# Altium schematic sheet fhd-hdr.SchDoc: fhd-hdr
size 453 x 317 mm; Origin: Eagle; Date: 5/1/2023 6:37:17 AM; SheetNumber: 1; GateName_1: G$1; SymbolName_1: FRAME_B_L; LibraryName: frames; DeviceSetName: FRAME_B_L; GateName_2: G$2; SymbolName_2: DOCFIELD; Sheet: Sheet:; REV: REV:
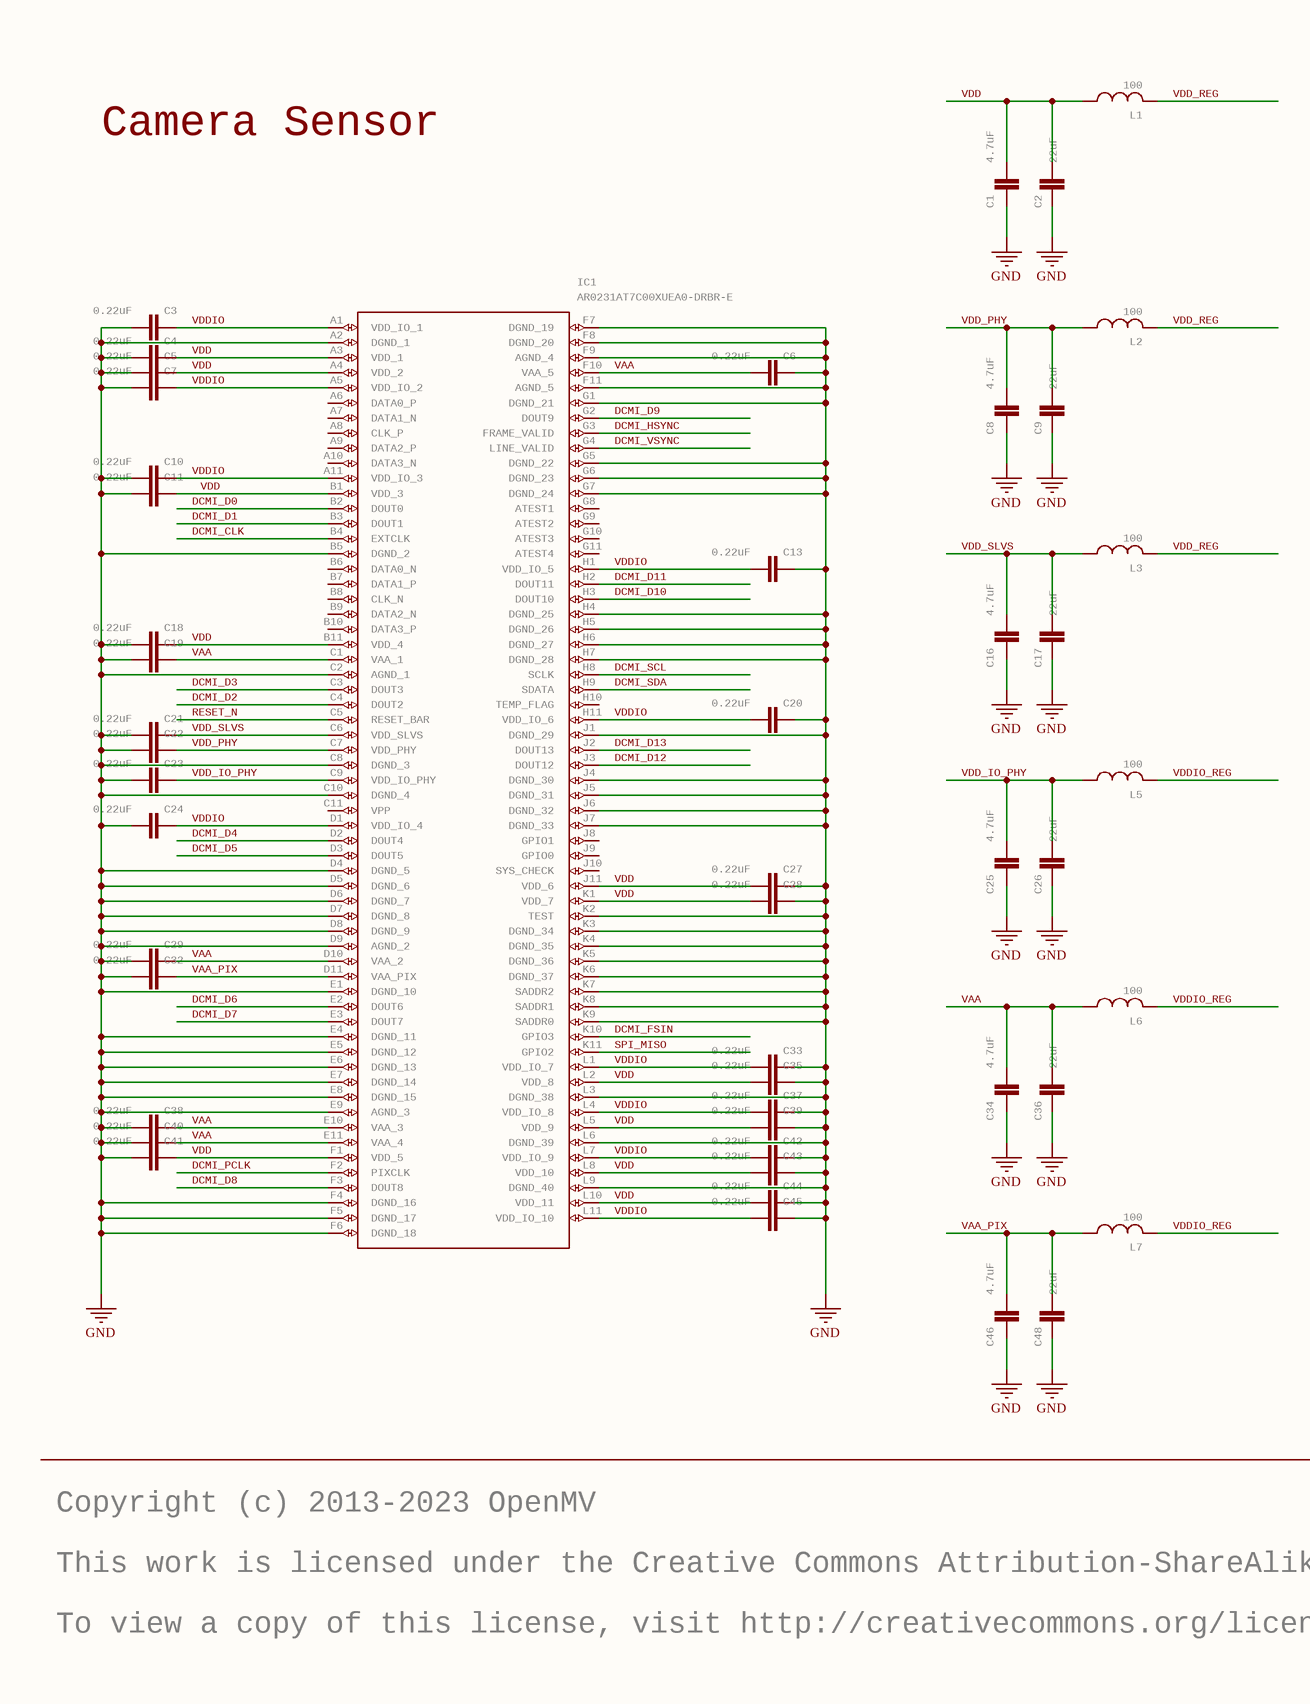
[diagram p0: fhd-hdr.SchDoc, left]
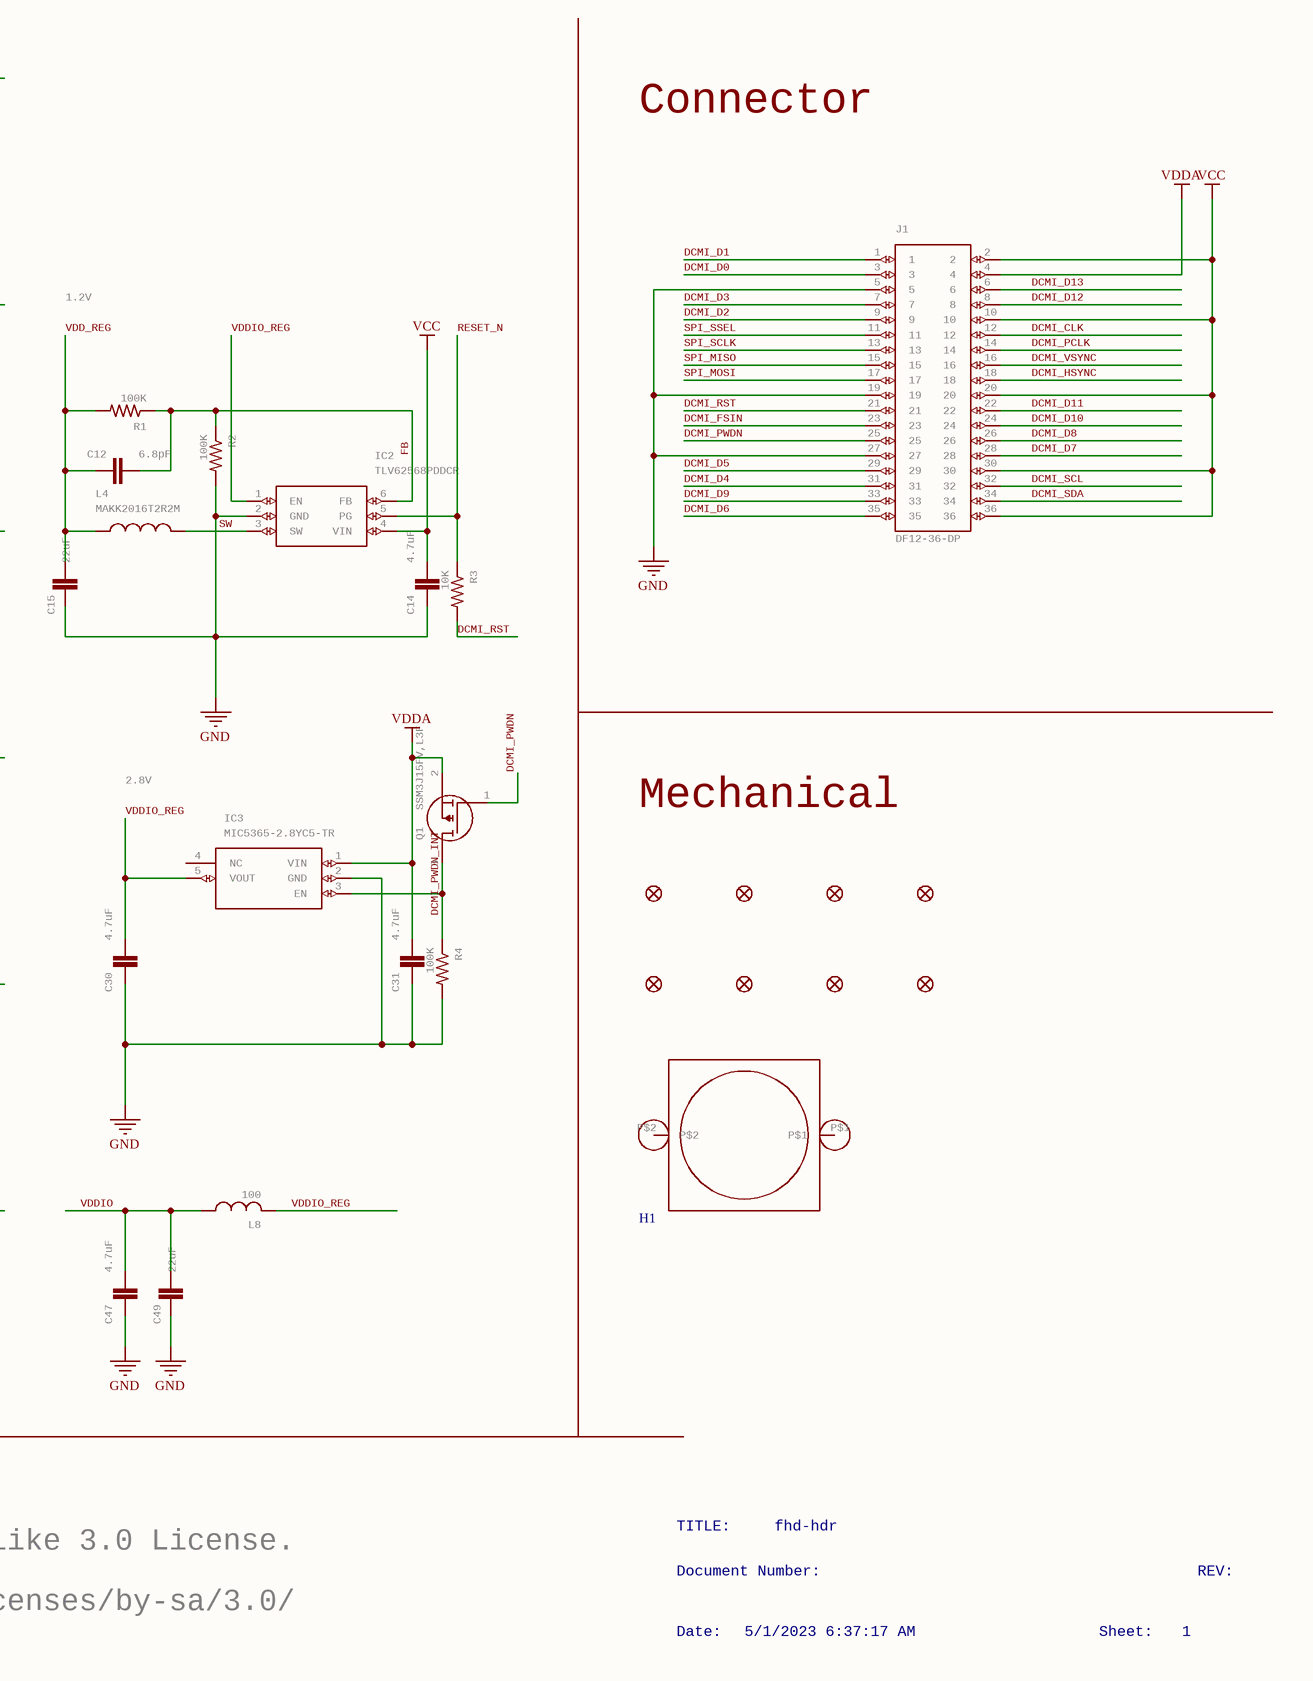
[diagram p1: fhd-hdr.SchDoc, right]

## Parts
C1  4.7uF  [0402]
C2  22uF  [0805]
C3  0.22uF  [C0201]
C4  0.22uF  [C0201]
C5  0.22uF  [C0201]
C6  0.22uF  [C0201]
C7  0.22uF  [C0201]
C8  4.7uF  [0402]
C9  22uF  [0805]
C10  0.22uF  [C0201]
C11  0.22uF  [C0201]
C12  6.8pF  [0402]
C13  0.22uF  [C0201]
C14  4.7uF  [0402]
C15  22uF  [0805]
C16  4.7uF  [0402]
C17  22uF  [0805]
C18  0.22uF  [C0201]
C19  0.22uF  [C0201]
C20  0.22uF  [C0201]
C21  0.22uF  [C0201]
C22  0.22uF  [C0201]
C23  0.22uF  [C0201]
C24  0.22uF  [C0201]
C25  4.7uF  [0402]
C26  22uF  [0805]
C27  0.22uF  [C0201]
C28  0.22uF  [C0201]
C29  0.22uF  [C0201]
C30  4.7uF  [0402]
C31  4.7uF  [0402]
C32  0.22uF  [C0201]
C33  0.22uF  [C0201]
C34  4.7uF  [0402]
C35  0.22uF  [C0201]
C36  22uF  [0805]
C37  0.22uF  [C0201]
C38  0.22uF  [C0201]
C39  0.22uF  [C0201]
C40  0.22uF  [C0201]
C41  0.22uF  [C0201]
C42  0.22uF  [C0201]
C43  0.22uF  [C0201]
C44  0.22uF  [C0201]
C45  0.22uF  [C0201]
C46  4.7uF  [0402]
C47  4.7uF  [0402]
C48  22uF  [0805]
C49  22uF  [0805]
FD1  FIDUCIAL1X2  [FIDUCIAL-1X2]  (value not drawn)
FD2  FIDUCIAL1X2  [FIDUCIAL-1X2]  (value not drawn)
FD3  FIDUCIAL1X2  [FIDUCIAL-1X2]  (value not drawn)
FD4  FIDUCIAL1X2  [FIDUCIAL-1X2]  (value not drawn)
FD5  FIDUCIAL1X2  [FIDUCIAL-1X2]  (value not drawn)
FD6  FIDUCIAL1X2  [FIDUCIAL-1X2]  (value not drawn)
FD7  FIDUCIAL1X2  [FIDUCIAL-1X2]  (value not drawn)
FD8  FIDUCIAL1X2  [FIDUCIAL-1X2]  (value not drawn)
H1  LENSMOUNT20MM  [LENSMOUNT-20MM]  (value not drawn)
IC1  AR0231AT7C00XUEA0-DRBR-E  [BGA121C80P11X11_1100X1000X155]
IC2  TLV62568PDDCR  [SOT95P280X110-6N]
IC3  MIC5365-2.8YC5-TR  [SOT65P210X110-5N]
J1  DF12-36-DP  [DF12-36-DP]
L1  100  [0402]
L2  100  [0402]
L3  100  [0402]
L4  MAKK2016T2R2M  [INDC2016X100N]
L5  100  [0402]
L6  100  [0402]
L7  100  [0402]
L8  100  [0402]
Q1  SSM3J15FV,L3F  [SSM3J15FV]
R1  100K  [R0402]
R2  100K  [R0402]
R3  10K  [R0402]
R4  100K  [R0402]

## Nets
GND: C1.1 C2.1 C3.2 C4.2 C5.2 C6.1 C7.2 C8.1 C9.1 C10.2 C11.2 C13.1 C14.1 C15.1 C16.1 C17.1 C18.2 C19.2 C20.1 C21.2 C22.2 C23.2 C24.2 C25.1 C26.1 C27.1 C28.1 C29.2 C30.1 C31.1 C32.2 C33.1 C34.1 C35.1 C36.1 C37.1 C38.2 C39.1 C40.2 C41.2 C42.1 C43.1 C44.1 C45.1 C46.1 C47.1 C48.1 C49.1 IC1.A2(DGND_1) IC1.B5(DGND_2) IC1.C2(AGND_1) IC1.C8(DGND_3) IC1.C10(DGND_4) IC1.D4(DGND_5) IC1.D5(DGND_6) IC1.D6(DGND_7) IC1.D7(DGND_8) IC1.D8(DGND_9) IC1.D9(AGND_2) IC1.E1(DGND_10) IC1.E4(DGND_11) IC1.E5(DGND_12) IC1.E6(DGND_13) IC1.E7(DGND_14) IC1.E8(DGND_15) IC1.E9(AGND_3) IC1.F4(DGND_16) IC1.F5(DGND_17) IC1.F6(DGND_18) IC1.F7(DGND_19) IC1.F8(DGND_20) IC1.F9(AGND_4) IC1.F11(AGND_5) IC1.G1(DGND_21) IC1.G5(DGND_22) IC1.G6(DGND_23) IC1.G7(DGND_24) IC1.H4(DGND_25) IC1.H5(DGND_26) IC1.H6(DGND_27) IC1.H7(DGND_28) IC1.J1(DGND_29) IC1.J4(DGND_30) IC1.J5(DGND_31) IC1.J6(DGND_32) IC1.J7(DGND_33) IC1.K2(TEST) IC1.K3(DGND_34) IC1.K4(DGND_35) IC1.K5(DGND_36) IC1.K6(DGND_37) IC1.K7(SADDR2) IC1.K8(SADDR1) IC1.K9(SADDR0) IC1.L3(DGND_38) IC1.L6(DGND_39) IC1.L9(DGND_40) IC2.2(GND) IC3.2(GND) J1.5 J1.19 J1.27 R2.2 R4.2
VCC: C14.2 IC2.4(VIN) J1.2 J1.10 J1.20 J1.30 J1.36
VDDA: C31.2 IC3.1(VIN) J1.4 Q1.2(S)
DCMI_CLK: IC1.B4(EXTCLK) J1.12
DCMI_D0: IC1.B2(DOUT0) J1.3
DCMI_D1: IC1.B3(DOUT1) J1.1
DCMI_D2: IC1.C4(DOUT2) J1.9
DCMI_D3: IC1.C3(DOUT3) J1.7
DCMI_D4: IC1.D2(DOUT4) J1.31
DCMI_D5: IC1.D3(DOUT5) J1.29
DCMI_D6: IC1.E2(DOUT6) J1.35
DCMI_D7: IC1.E3(DOUT7) J1.28
DCMI_D8: IC1.F3(DOUT8) J1.26
DCMI_D9: IC1.G2(DOUT9) J1.33
DCMI_D10: IC1.H3(DOUT10) J1.24
DCMI_D11: IC1.H2(DOUT11) J1.22
DCMI_D12: IC1.J3(DOUT12) J1.8
DCMI_D13: IC1.J2(DOUT13) J1.6
DCMI_FSIN: IC1.K10(GPIO3) J1.23
DCMI_HSYNC: IC1.G3(FRAME_VALID) J1.18
DCMI_PCLK: IC1.F2(PIXCLK) J1.14
DCMI_PWDN: J1.25 Q1.1(G)
DCMI_PWDN_INT: IC3.3(EN) Q1.3(D) R4.1
DCMI_RST: J1.21 R3.2
DCMI_SCL: IC1.H8(SCLK) J1.32
DCMI_SDA: IC1.H9(SDATA) J1.34
DCMI_VSYNC: IC1.G4(LINE_VALID) J1.16
FB: C12.2 IC2.6(FB) R1.1 R2.1
RESET_N: IC1.C5(RESET_BAR) IC2.5(PG) R3.1
SPI_MISO: IC1.K11(GPIO2) J1.15
SPI_MOSI: J1.17
SPI_SCLK: J1.13
SPI_SSEL: J1.11
SW: IC2.3(SW) L4.2
VAA: C6.2 C19.1 C29.1 C34.2 C36.2 C38.1 C40.1 IC1.C1(VAA_1) IC1.D10(VAA_2) IC1.E10(VAA_3) IC1.E11(VAA_4) IC1.F10(VAA_5) L6.1(P$1)
VAA_PIX: C32.1 C46.2 C48.2 IC1.D11(VAA_PIX) L7.1(P$1)
VDD: C1.2 C2.2 C4.1 C5.1 C11.1 C18.1 C27.2 C28.2 C35.2 C39.2 C41.1 C43.2 C44.2 IC1.A3(VDD_1) IC1.A4(VDD_2) IC1.B1(VDD_3) IC1.B11(VDD_4) IC1.F1(VDD_5) IC1.J11(VDD_6) IC1.K1(VDD_7) IC1.L2(VDD_8) IC1.L5(VDD_9) IC1.L8(VDD_10) IC1.L10(VDD_11) L1.1(P$1)
VDD_IO_PHY: C23.1 C25.2 C26.2 IC1.C9(VDD_IO_PHY) L5.1(P$1)
VDD_PHY: C8.2 C9.2 C22.1 IC1.C7(VDD_PHY) L2.1(P$1)
VDD_REG: C12.1 C15.2 L1.2(P$2) L2.2(P$2) L3.2(P$2) L4.1 R1.2
VDD_SLVS: C16.2 C17.2 C21.1 IC1.C6(VDD_SLVS) L3.1(P$1)
VDDIO: C3.1 C7.1 C10.1 C13.2 C20.2 C24.1 C33.2 C37.2 C42.2 C45.2 C47.2 C49.2 IC1.A1(VDD_IO_1) IC1.A5(VDD_IO_2) IC1.A11(VDD_IO_3) IC1.D1(VDD_IO_4) IC1.H1(VDD_IO_5) IC1.H11(VDD_IO_6) IC1.L1(VDD_IO_7) IC1.L4(VDD_IO_8) IC1.L7(VDD_IO_9) IC1.L11(VDD_IO_10) L8.1(P$1)
VDDIO_REG: C30.2 IC2.1(EN) IC3.5(VOUT) L5.2(P$2) L6.2(P$2) L7.2(P$2) L8.2(P$2)

Not connected (* = marked no-connect by the designer): H1 P$1 P$2; IC1 A6(DATA0_P) A7(DATA1_N) A8(CLK_P) A9(DATA2_P) A10(DATA3_N) B6(DATA0_N) B7(DATA1_P) B8(CLK_N) B9(DATA2_N) B10(DATA3_P) C11(VPP) G8(ATEST1) G9(ATEST2) G10(ATEST3) G11(ATEST4) H10(TEMP_FLAG) J8(GPIO1) J9(GPIO0) J10(SYS_CHECK); IC3 4(NC)

## Notes on the sheet
- Camera Sensor
- Connector
- 1.2V
- 2.8V
- Mechanical
- Copyright (c) 2013-2023 OpenMV
- TITLE:
- fhd-hdr
- This work is licensed under the Creative Commons Attribution-ShareAlike 3.0 License.
- To view a copy of this license, visit http://creativecommons.org/licenses/by-sa/3.0/
- Document Number:
- REV:
- Date:
- 5/1/2023 6:37:17 AM
- Sheet:
- 1

## Library data of the parts
C1 C8 C14 C16 C25 C30 C31 C34 C46 C47 = CAP_0402: 0402 (1005 Metric) Nick Garner - TeleSense; MPN: JMK105BBJ475MV-F; GateName_1: G$1; SymbolName_1: CAP; LibraryName: 0402; DeviceSetName: CAP_0402
C2 C9 C15 C17 C26 C36 C48 C49 = 22UF-0805-6.3V-20%: 22ÂµF ceramic capacitors    A capacitor is a passive two-terminal electrical component used to store electrical energy temporarily in an electric field.; MPN: CL21A226MQQNNNE; GateName_1: G$1; SymbolName_1: CAP; PROD_ID: CAP-08402; DeviceName: -0805-6.3V-20%; LibraryName: SparkFun-Capacitors; DeviceSetName: 22UF
C3-C7 C10 C11 C13 C18-C24 C27-C29 C32 C33 C35 C37-C45 = C-EUC0201: CAPACITOR, European symbol; MPN: GRM033R60J224ME15D; GateName_1: G$1; SymbolName_1: C-EU; POPULARITY: 0; DeviceName: C0201; LibraryName: rcl; DeviceSetName: C-EU; SPICEPREFIX: C
C12 = CAP_0402: 0402 (1005 Metric) Nick Garner - TeleSense; MPN: GRM1555C1H6R8DA01D; GateName_1: G$1; SymbolName_1: CAP; LibraryName: 0402; DeviceSetName: CAP_0402
FD1-FD8 = FIDUCIAL1X2: Fiducial Alignment Points    Point-of-reference for pick-and-place machines and other optical instruments.; GateName_1: G$1; DeviceName: 1X2; SymbolName_1: FIDUCIAL; LibraryName: SparkFun-Aesthetics; DeviceSetName: FIDUCIAL
H1 = LENSMOUNT20MM: GateName_1: G$1; SymbolName_1: LENS; DeviceName: 20MM; LibraryName: lensmount; DeviceSetName: LENSMOUNT
IC1 = AR0231AT7C00XUEA0-DRBR-E: Image Sensor Color CMOS 1928 x 1208Pixels   Source:  Datasheet; MANUFACTURER_NAME: onsemi; MPN: AR0231AT7C00XUEA0-DPBR; GateName_1: G$1; SymbolName_1: AR0231AT7C00XUEA0-DRBR-E; LibraryName: AR0231AT7C00XUEA0-DRBR-E; DeviceSetName: AR0231AT7C00XUEA0-DRBR-E; ARROW_PART_NUMBER: ARROW_PART_NUMBER; ARROW_PRICE-STOCK: ARROW_PRICE-STOCK; HEIGHT: 1.55mm; MANUFACTURER_PART_NUMBER: AR0231AT7C00XUEA0-DRBR-E; MOUSER_PART_NUMBER: MOUSER_PART_NUMBER; MOUSER_PRICE-STOCK: MOUSER_PRICE-STOCK
IC2 = TLV62568PDDCR: 2.5V-5.5V input, 1A high efficiency step-down buck converter in SOT23 and SOT563 package   Source:  Datasheet; MANUFACTURER_NAME: Texas Instruments; GateName_1: G$1; SymbolName_1: TLV62568PDDCR; LibraryName: TLV62568PDDCR; DeviceSetName: TLV62568PDDCR; HEIGHT: 1.1mm; MANUFACTURER_PART_NUMBER: TLV62568PDDCR; MOUSER_PART_NUMBER: 595-TLV62568PDDCR; MOUSER_PRICE-STOCK: https://www.mouser.co.uk/ProductDetail/Texas-Instruments/TLV62568PDDCR?qs=1mbolxNpo8f1FPchIXcxyQ%3D%3D; MPN: TLV62568PDDCR
IC3 = MIC5365-2.8YC5-TR: IC REG LINEAR 2.8V 150MA SC70-5   Source:  Datasheet; MANUFACTURER_NAME: Microchip; GateName_1: G$1; SymbolName_1: MIC5365-2.8YC5-TR; LibraryName: MIC5365-2.8YC5-TR; DeviceSetName: MIC5365-2.8YC5-TR; HEIGHT: 1.1mm; MANUFACTURER_PART_NUMBER: MIC5365-2.8YC5-TR; MOUSER_PART_NUMBER: 998-MIC5365-2.8YC5TR; MOUSER_PRICE-STOCK: https://www.mouser.co.uk/ProductDetail/Microchip-Technology-Atmel/MIC5365-2.8YC5-TR?qs=U6T8BxXiZAX3mJDSWJyjVA%3D%3D; MPN: MIC5365-2.8YC5-TR
J1 = DF12-36-DP: MPN: DF12NB(3.0)-36DP-0.5V(51); GateName_1: G$1; SymbolName_1: DF12-36; LibraryName: DF12NB(3.0)-36DP-0.5V(51); DeviceSetName: DF12-36-DP
L1-L3 L5-L8 = INDUCTOR_0402: MPN: MFBM1V1005-101-R; GateName_1: G$1; SymbolName_1: INDUCTOR; LibraryName: 0402; DeviceSetName: INDUCTOR_0402
L4 = MAKK2016T2R2M: INDUCTOR, METAL CORE Check availability; GateName_1: G$1; MF: Taiyo Yuden; SymbolName_1: MAKK2016T2R2M; LibraryName: MAKK2016T2R2M; DeviceSetName: MAKK2016T2R2M; AVAILABILITY: In Stock; MP: MAKK2016T2R2M; MPN: MAKK2016T2R2M; PACKAGE: 2016 Taiyo Yuden; PRICE: None; PURCHASE-URL: https://pricing.snapeda.com/search/part/MAKK2016T2R2M/?ref=eda
Q1 = PMXB120EPEZ: MOSFET 30 V, P-channel Trench MOSFET   Source:  Datasheet; GateName_1: G$1; SymbolName_1: SSM3J15FV,L3F; LibraryName: SSM3J15FV,L3F; DeviceSetName: SSM3J15FV,L3F; HEIGHT: 0.4mm; MANUFACTURER_PART_NUMBER: SSM3J15FV,L3F; MPN: SSM3J15FV,L3F
R1 R2 R4 = R-US_R0402: RESISTOR, American symbol; MPN: AC0402FR-07100KL; GateName_1: G$1; SymbolName_1: R-US; DeviceSetName: R-US_; POPULARITY: 34; DeviceName: R0402; LibraryName: rcl; SPICEPREFIX: R
R3 = R-US_R0402: RESISTOR, American symbol; MPN: AC0402FR-1310KL; GateName_1: G$1; SymbolName_1: R-US; DeviceSetName: R-US_; POPULARITY: 34; DeviceName: R0402; LibraryName: rcl; SPICEPREFIX: R